# Altium schematic sheet redx.SchDoc
size A4
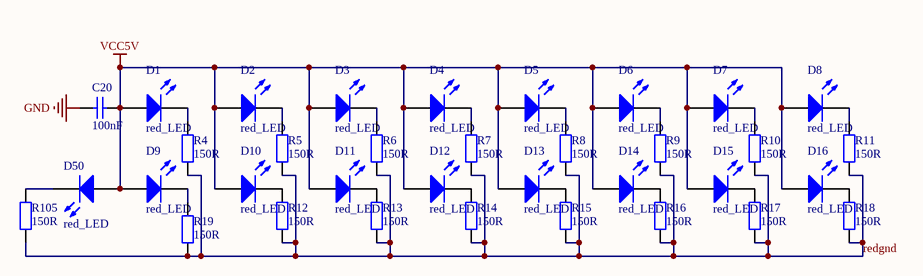
[diagram p0: redx.SchDoc]

## Parts
C20  100nF  [CC2012-0805]
D1  red_LED  [LED5MM]
D2  red_LED  [LED5MM]
D3  red_LED  [LED5MM]
D4  red_LED  [LED5MM]
D5  red_LED  [LED5MM]
D6  red_LED  [LED5MM]
D7  red_LED  [LED5MM]
D8  red_LED  [LED5MM]
D9  red_LED  [LED5MM]
D10  red_LED  [LED5MM]
D11  red_LED  [LED5MM]
D12  red_LED  [LED5MM]
D13  red_LED  [LED5MM]
D14  red_LED  [LED5MM]
D15  red_LED  [LED5MM]
D16  red_LED  [LED5MM]
D50  red_LED  [LED5MM]
R4  150R  [CR2012-0805]
R5  150R  [CR2012-0805]
R6  150R  [CR2012-0805]
R7  150R  [CR2012-0805]
R8  150R  [CR2012-0805]
R9  150R  [CR2012-0805]
R10  150R  [CR2012-0805]
R11  150R  [CR2012-0805]
R12  150R  [CR2012-0805]
R13  150R  [CR2012-0805]
R14  150R  [CR2012-0805]
R15  150R  [CR2012-0805]
R16  150R  [CR2012-0805]
R17  150R  [CR2012-0805]
R18  150R  [CR2012-0805]
R19  150R  [CR2012-0805]
R105  150R  [CR2012-0805]

## Nets
GND: C20.2
VCC5V: C20.1 D1.1(A) D2.1(A) D3.1(A) D4.1(A) D5.1(A) D6.1(A) D7.1(A) D8.1(A) D9.1(A) D10.1(A) D11.1(A) D12.1(A) D13.1(A) D14.1(A) D15.1(A) D16.1(A) D50.1(A)
redgnd: R4.1 R5.1 R6.1 R7.1 R8.1 R9.1 R10.1 R11.1 R12.1 R13.1 R14.1 R15.1 R16.1 R17.1 R18.1 R19.1 R105.1
NetD1_2: D1.2(K) R4.2
NetD2_2: D2.2(K) R5.2
NetD3_2: D3.2(K) R6.2
NetD4_2: D4.2(K) R7.2
NetD5_2: D5.2(K) R8.2
NetD6_2: D6.2(K) R9.2
NetD7_2: D7.2(K) R10.2
NetD8_2: D8.2(K) R11.2
NetD9_2: D9.2(K) R19.2
NetD10_2: D10.2(K) R12.2
NetD11_2: D11.2(K) R13.2
NetD12_2: D12.2(K) R14.2
NetD13_2: D13.2(K) R15.2
NetD14_2: D14.2(K) R16.2
NetD15_2: D15.2(K) R17.2
NetD16_2: D16.2(K) R18.2
NetD50_2: D50.2(K) R105.2

## Library data of the parts
C20 = Cap Semi: Capacitor (Semiconductor SIM Model); Published: 8-Jun-2000; LatestRevisionDate: 17-Jul-2002; LatestRevisionNote: Re-released for DXP Platform.; PackageReference: C1206; Publisher: Altium Limited
D1-D16 D50 = LED: Typical RED GaAs LED; Published: 8-Jun-2000; LatestRevisionDate: 08-Jul-2005; LatestRevisionNote: Mech Layer 1 removed.; PackageReference: LED-1; Publisher: Altium Limited
R4-R19 R105 = Res2: Resistor; Published: 8-Jun-2000; Revision: July-2002: Re-released for DXP Platform.; Publisher: Altium Limited; Value: 150R